# EAGLE schematic AlphanumericDisplay (EAGLE 7.6.0)
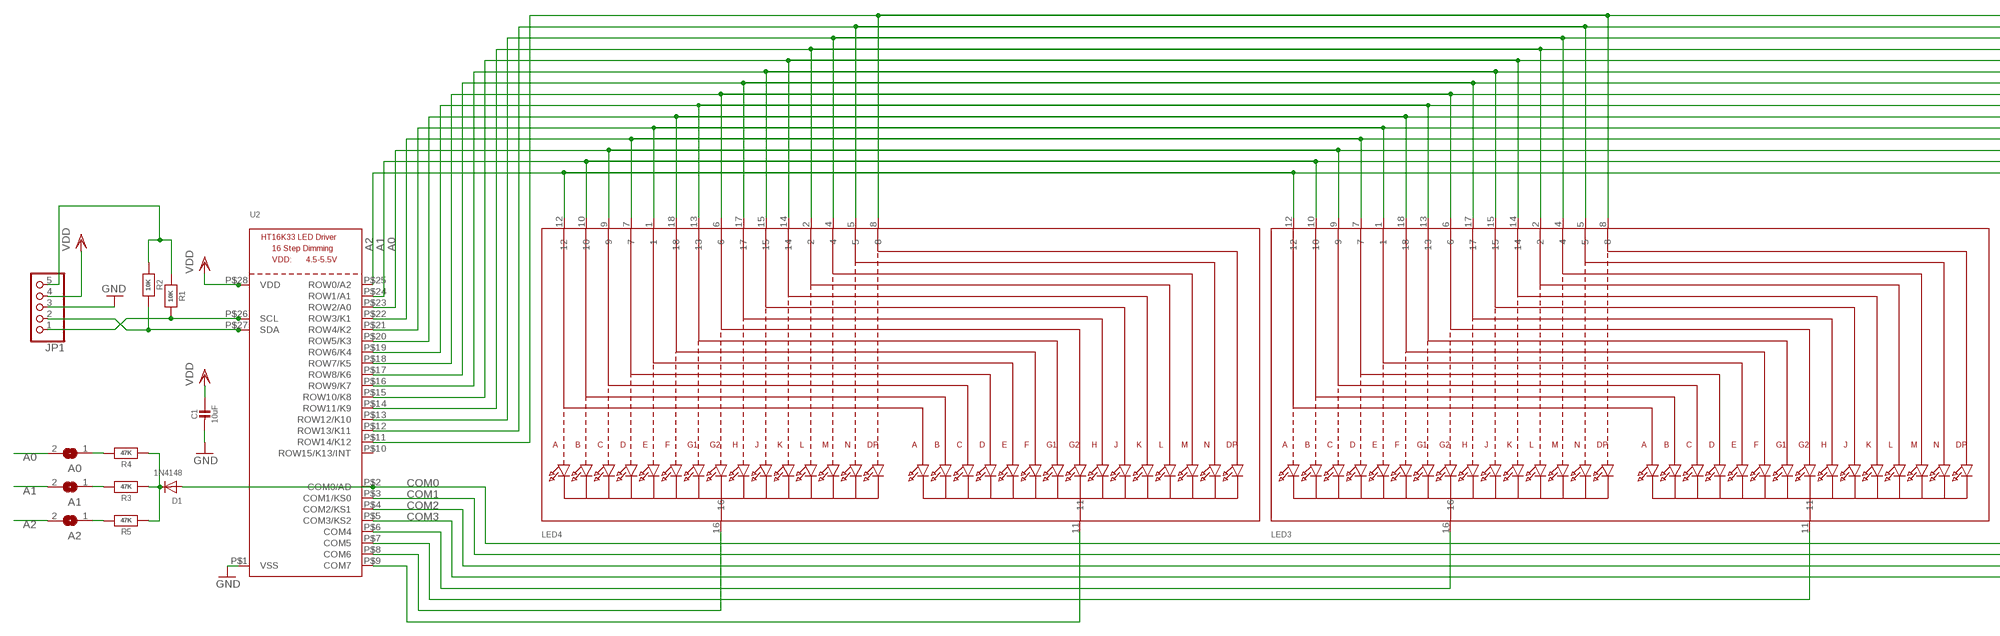
[diagram p0: schematic, sheet 1, part 1 of 2]
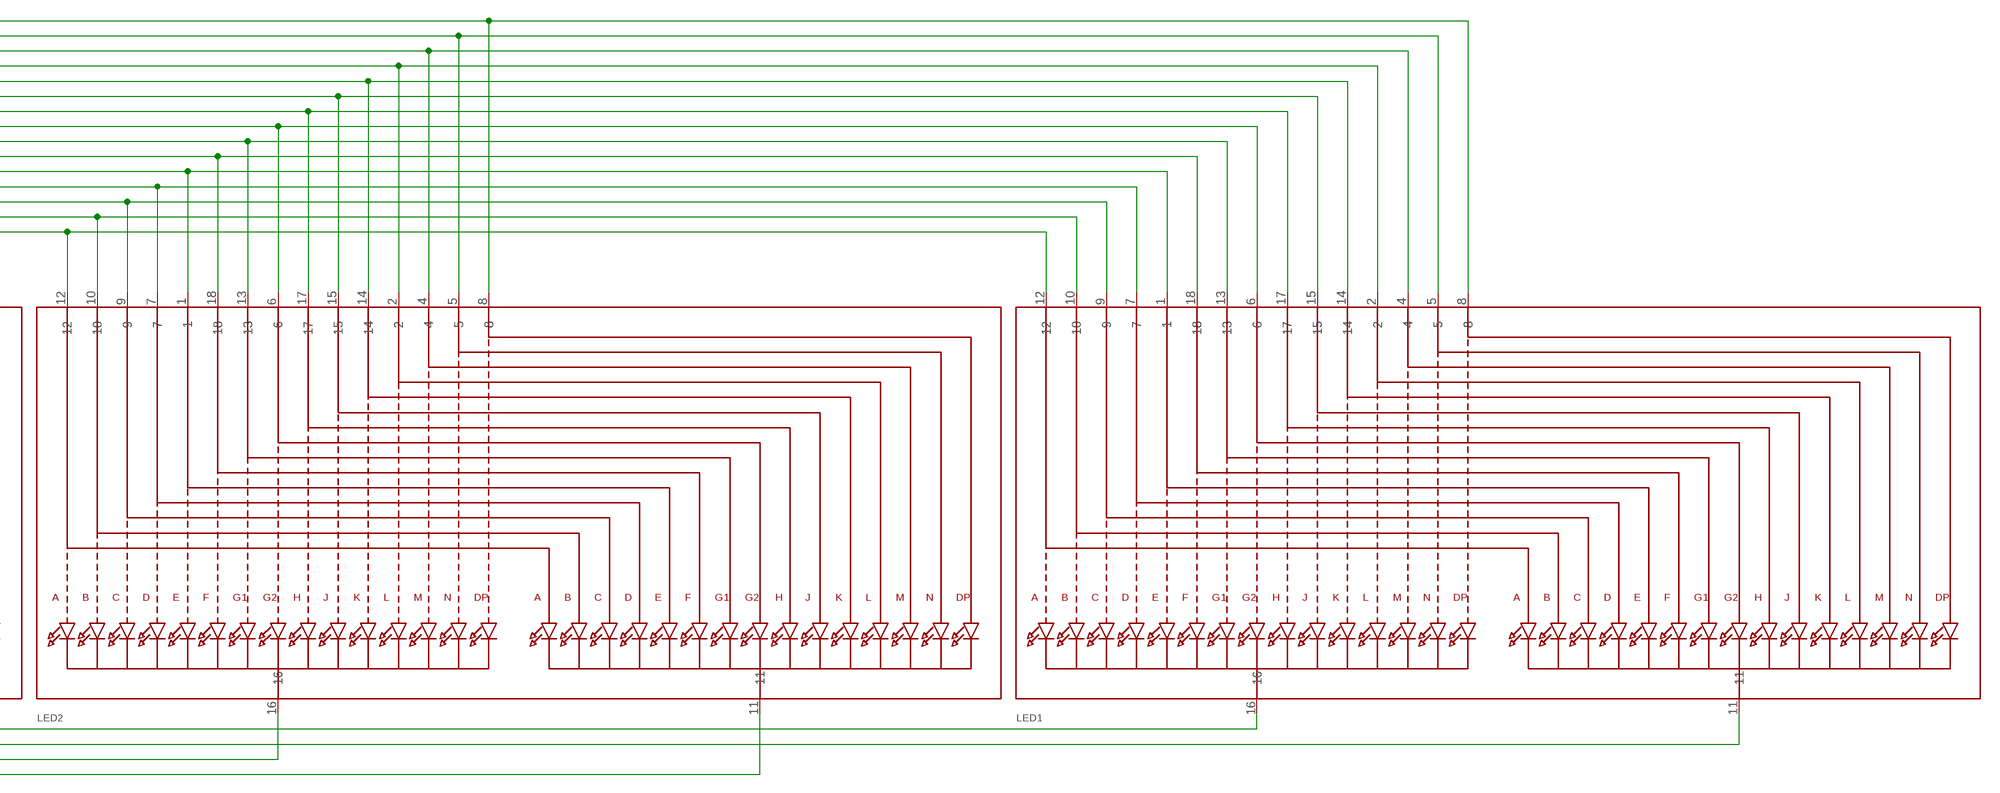
[diagram p1: schematic, sheet 1, part 2 of 2]

## Parts
A0  SOLDERJUMPERREFLOW_NOPASTE  [SOLDERJUMPER_REFLOW_NOPASTE]
A1  SOLDERJUMPERREFLOW_NOPASTE  [SOLDERJUMPER_REFLOW_NOPASTE]
A2  SOLDERJUMPERREFLOW_NOPASTE  [SOLDERJUMPER_REFLOW_NOPASTE]
C1  10uF  CAP_CERAMIC0805-NOOUTLINE  [0805-NO]
D1  1N4148  DIODESOD-323F  [SOD-323F]
JP1  HEADER-1X570MIL  [1X05_ROUND_70]
LED1  DISP_SEGMENT_STARBURST_DUAL_COMMONCATHODE  [SEGMENT_STARTBUST_DUAL_KWA-541CBB]
LED2  DISP_SEGMENT_STARBURST_DUAL_COMMONCATHODE  [SEGMENT_STARTBUST_DUAL_KWA-541CBB]
LED3  DISP_SEGMENT_STARBURST_DUAL_COMMONCATHODE  [SEGMENT_STARTBUST_DUAL_KWA-541CBB]
LED4  DISP_SEGMENT_STARBURST_DUAL_COMMONCATHODE  [SEGMENT_STARTBUST_DUAL_KWA-541CBB]
R1  10K  RESISTOR0805_NOOUTLINE  [0805-NO]
R2  10K  RESISTOR0805_NOOUTLINE  [0805-NO]
R3  47K  RESISTOR0805_NOOUTLINE  [0805-NO]
R4  47K  RESISTOR0805_NOOUTLINE  [0805-NO]
R5  47K  RESISTOR0805_NOOUTLINE  [0805-NO]
U2  HT16K33_SOP28  [SOP28_300MIL]

## Nets
A0: A0.2 LED1.9 LED2.9 LED3.9 LED4.9 U2.P$23(ROW2/A0)
A1: A1.2 LED1.10 LED2.10 LED3.10 LED4.10 U2.P$24(ROW1/A1)
A2: A2.2 LED1.12 LED2.12 LED3.12 LED4.12 U2.P$25(ROW0/A2)
COM0: D1.A LED1.16 U2.P$2(COM0/AD)
COM1: LED1.11 U2.P$3(COM1/KS0)
COM2: LED2.16 U2.P$4(COM2/KS1)
COM3: LED2.11 U2.P$5(COM3/KS2)
COM4: LED3.16 U2.P$6(COM4)
COM5: LED3.11 U2.P$7(COM5)
GND: C1.2 JP1.3 U2.P$1(VSS)
N$1: D1.C R3.1 R4.1 R5.1
N$2: JP1.5 R1.1 R2.1
N$4: LED1.17 LED2.17 LED3.17 LED4.17 U2.P$17(ROW8/K6)
N$5: LED1.15 LED2.15 LED3.15 LED4.15 U2.P$16(ROW9/K7)
N$6: LED1.14 LED2.14 LED3.14 LED4.14 U2.P$15(ROW10/K8)
N$7: A2.1 R5.2
N$8: LED1.2 LED2.2 LED3.2 LED4.2 U2.P$14(ROW11/K9)
N$9: LED1.4 LED2.4 LED3.4 LED4.4 U2.P$13(ROW12/K10)
N$10: LED1.7 LED2.7 LED3.7 LED4.7 U2.P$22(ROW3/K1)
N$11: LED1.1 LED2.1 LED3.1 LED4.1 U2.P$21(ROW4/K2)
N$12: LED1.18 LED2.18 LED3.18 LED4.18 U2.P$20(ROW5/K3)
N$13: LED1.13 LED2.13 LED3.13 LED4.13 U2.P$19(ROW6/K4)
N$14: LED1.5 LED2.5 LED3.5 LED4.5 U2.P$12(ROW13/K11)
N$15: LED1.8 LED2.8 LED3.8 LED4.8 U2.P$11(ROW14/K12)
N$16: LED1.6 LED2.6 LED3.6 LED4.6 U2.P$18(ROW7/K5)
N$19: A1.1 R3.2
N$20: A0.1 R4.2
N$23: LED4.16 U2.P$8(COM6)
N$24: LED4.11 U2.P$9(COM7)
SCL: JP1.1 R1.2 U2.P$26(SCL)
SDA: JP1.2 R2.2 U2.P$27(SDA)
VDD: C1.1 JP1.4 U2.P$28(VDD)
Unconnected: U2.P$10(ROW15/K13/INT)

## Library data of the parts
A0 A1 A2 = microbuilder:SOLDERJUMPER: SMD Solder JUMPER Solder the two pads together to create a connection, or remove the solder to break it. REFLOW - Use this footprint for solder paste and reflow ovens. WAVE - Use this footprint for hand-soldering (larger pads). CLOSED - Has a trace between the two pads to ensure it is closed by default. The trace needs to be cut to disable the jumper, and can be closed again by creating a solder bridge between the two pads.
C1 = microbuilder:CAP_CERAMIC: Ceramic Capacitors For new designs, use the packages preceded by an '_' character since they are more reliable: The following footprints should be used on most boards: _0402 - Standard footprint for regular board layouts _0603 - Standard footprint for regular board layouts _0805 - Standard footprint for regular board layouts _1206 - Standard footprint for regular board layouts For extremely tight-pitch boards where space is at a premium, the following 'micro-pitch' footprints can be used (smaller pads, no silkscreen outline, etc.): _0402MP - Micro-pitch footprint for very dense/compact boards _0603MP - Micro-pitch footprint for very dense/compact boards _0805MP - Micro-pitch footprint for very dense/compact boards _1206MP - Micro-pitch footprint for very dense/compact boards
D1 = adafruit:DIODE: Diode SMADIODE - SMA Surface Mount Package 20V 1A Schottky Diode Digikey: 641-1014-6-ND DO-1N4148 - Through Hole Small Current Diode SOD-123 20V 1 A (.5mV Vf) Schottky Diode - Digikey: MBRX120TPMSCT-ND SOD-323 10V 570mA (.38mV Vf, 3ns) Schottky Diode - Digikey: ZLLS410CT-ND SOD-523 30V 30mA Schottky Diode (RB751S-40TE61) - Digikey: RB751S-40TE61CT-ND SOT23-R/W - SOT23 Package (R = Solder Paste/Reflow Ovens, W = Hand-Soldering) BAT54Film 40V 300mA - Digikey: 497-7162-1-ND
JP1 = microbuilder:HEADER-1X5: PIN HEADER
LED1-LED4 = microbuilder:DISP_SEGMENT_STARBURST_DUAL_COMMONCATHODE: 2 x Starburst Segment Displays - Common Cathode Luckylight KWA-541CBB
R1-R5 = microbuilder:RESISTOR: Resistors For new designs, use the packages preceded by an '_' character since they are more reliable: The following footprints should be used on most boards: _0402 - Standard footprint for regular board layouts _0603 - Standard footprint for regular board layouts _0805 - Standard footprint for regular board layouts _1206 - Standard footprint for regular board layouts For extremely tight-pitch boards where space is at a premium, the following 'micro-pitch' footprints can be used (smaller pads, no silkscreen outline, etc.): _0402MP - Micro-pitch footprint for very dense/compact boards _0603MP - Micro-pitch footprint for very dense/compact boards _0805MP - Micro-pitch footprint for very dense/compact boards _1206MP - Micro-pitch footprint for very dense/compact boards
U2 = microbuilder:HT16K33_SOP28